# EAGLE schematic d11_micro_std_vcp (EAGLE 7.3.0)
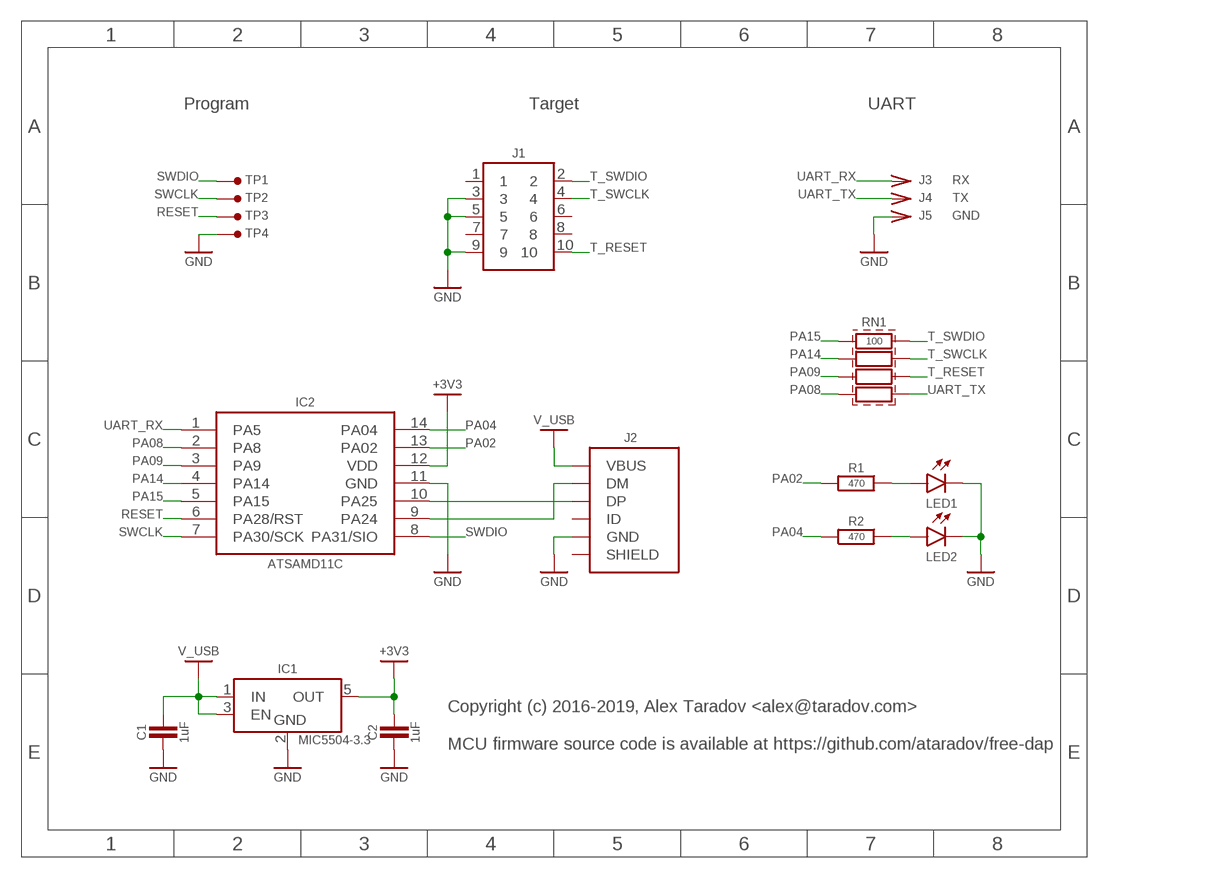
[diagram p0: schematic, sheet 1]

## Parts
C1  1uF  C-0603  [SMD0603]
C2  1uF  C-0603  [SMD0603]
IC1  MIC5504-3.3  MIC5504-SOT23-5  [SOT23-5]
IC2  ATSAMD11C  [SO-14]
J1  HEADER-5X2-TH-1.27  [HEADER-5X2-1.27MM]
J2  USB-B-MICRO-SMT  [USB-B-MICRO-SMT-SHELL-TH]
J3  RX  CONN-SINGLE-TH  [PIN-TH]
J4  TX  CONN-SINGLE-TH  [PIN-TH]
J5  GND  CONN-SINGLE-TH  [PIN-TH]
LED1  LED_SMDLED_0603  [SMD0603]
LED2  LED_SMDLED_0603  [SMD0603]
R1  470  R-0603  [SMD0603]
R2  470  R-0603  [SMD0603]
RN1  100  RN-4-0603-X4  [SMD0603-X4]
TP1  SIO  TEST-POINT-1.27MM  [TP-1.27MM]
TP2  TEST-POINT-1.27MM  [TP-1.27MM]
TP3  TEST-POINT-1.27MM  [TP-1.27MM]
TP4  TEST-POINT-1.27MM  [TP-1.27MM]

## Nets
+3V3: C2.2 IC1.5(OUT) IC2.12(VDD)
GND: C1.1 C2.1 IC1.2(GND) IC2.11(GND) J1.3 J1.5 J1.9 J2.5(GND) J5.1 LED1.2(C) LED2.2(C) TP4.1
N$1: IC2.9(PA24) J2.2(DM)
N$2: IC2.10(PA25) J2.3(DP)
N$4: LED1.1(A) R1.2
N$6: LED2.1(A) R2.2
PA02: IC2.13(PA02) R1.1
PA04: IC2.14(PA04) R2.1
PA08: IC2.2(PA8) RN1.4
PA09: IC2.3(PA9) RN1.3
PA14: IC2.4(PA14) RN1.2
PA15: IC2.5(PA15) RN1.1
RESET: IC2.6(PA28/RST) TP3.1
SWCLK: IC2.7(PA30/SCK) TP2.1
SWDIO: IC2.8(PA31/SIO) TP1.1
T_RESET: J1.10 RN1.6
T_SWCLK: J1.4 RN1.7
T_SWDIO: J1.2 RN1.8
UART_RX: IC2.1(PA5) J3.1
UART_TX: J4.1 RN1.5
V_USB: C1.2 IC1.1(IN) IC1.3(EN) J2.1(VBUS)
Unconnected: J1.1 J1.6 J1.7 J1.8 J2.4(ID) J2.M1(SHIELD) J2.M2(SHIELD) J2.M3(SHIELD) J2.M4(SHIELD)

## Notes on the sheet
- Program | Target | UART
- Copyright (c) 2016-2019, Alex Taradov <alex@taradov.com>
  
  MCU firmware source code is available at https://github.com/ataradov/free-dap

## Library data of the parts
C1 C2 = ataradov_rlc:C
IC1 = ataradov_vreg:MIC5504: LM1117 voltage regulator
IC2 = ataradov_mcu:ATSAMD11C
J1 = ataradov_conn:HEADER-5X2
J2 = ataradov_conn:USB-B-MICRO
J3-J5 = ataradov_conn:CONN-SINGLE
LED1 LED2 = ataradov_led:LED_SMD: SMD_LED
R1 R2 = ataradov_rlc:R
RN1 = ataradov_rlc:RN-4
TP1-TP4 = ataradov_misc:TEST-POINT: Test Point